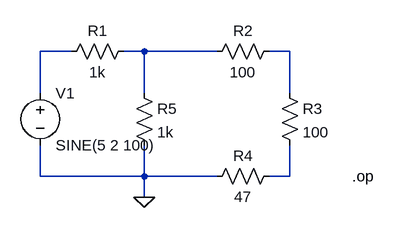
[diagram p0: schematic prelab1.asc]
prelab1.asc, the LTspice schematic file:
Version 4
SHEET 1 900 680
WIRE 304 224 256 224
WIRE 416 224 384 224
WIRE 528 224 416 224
WIRE 640 224 608 224
WIRE 256 288 256 224
WIRE 416 288 416 224
WIRE 640 288 640 224
WIRE 256 416 256 368
WIRE 416 416 416 368
WIRE 416 416 256 416
WIRE 528 416 416 416
WIRE 640 416 640 368
WIRE 640 416 608 416
WIRE 416 448 416 416
FLAG 416 448 0
DATAFLAG 288 224 "$"
DATAFLAG 400 224 "$"
DATAFLAG 640 224 "$"
DATAFLAG 640 416 "$"
DATAFLAG 416 416 "$"
SYMBOL voltage 256 272 R0
SYMATTR InstName V1
SYMATTR Value SINE(5 2 100)
SYMBOL res 624 272 R0
SYMATTR InstName R3
SYMATTR Value 100
SYMBOL res 400 272 R0
SYMATTR InstName R5
SYMATTR Value 1k
SYMBOL Res 400 208 R90
WINDOW 0 0 56 VBottom 2
WINDOW 3 32 56 VTop 2
SYMATTR InstName R1
SYMATTR Value 1k
SYMBOL Res 624 400 R90
WINDOW 0 0 56 VBottom 2
WINDOW 3 32 56 VTop 2
SYMATTR InstName R4
SYMATTR Value 47
SYMBOL Res 624 208 R90
WINDOW 0 0 56 VBottom 2
WINDOW 3 32 56 VTop 2
SYMATTR InstName R2
SYMATTR Value 100
TEXT 736 416 Left 2 !.op

The netlist it stands for:
* prelab1.asc
V1 N001 0 SINE(5 2 100)
R3 N003 N004 100
R5 N002 0 1k
R1 N002 N001 1k
R4 N004 0 47
R2 N003 N002 100
.op
.backanno
.end